# Altium schematic sheet USB-HUB-MUX.SchDoc
size A3; SheetNumber: 9; SheetTotal: 22
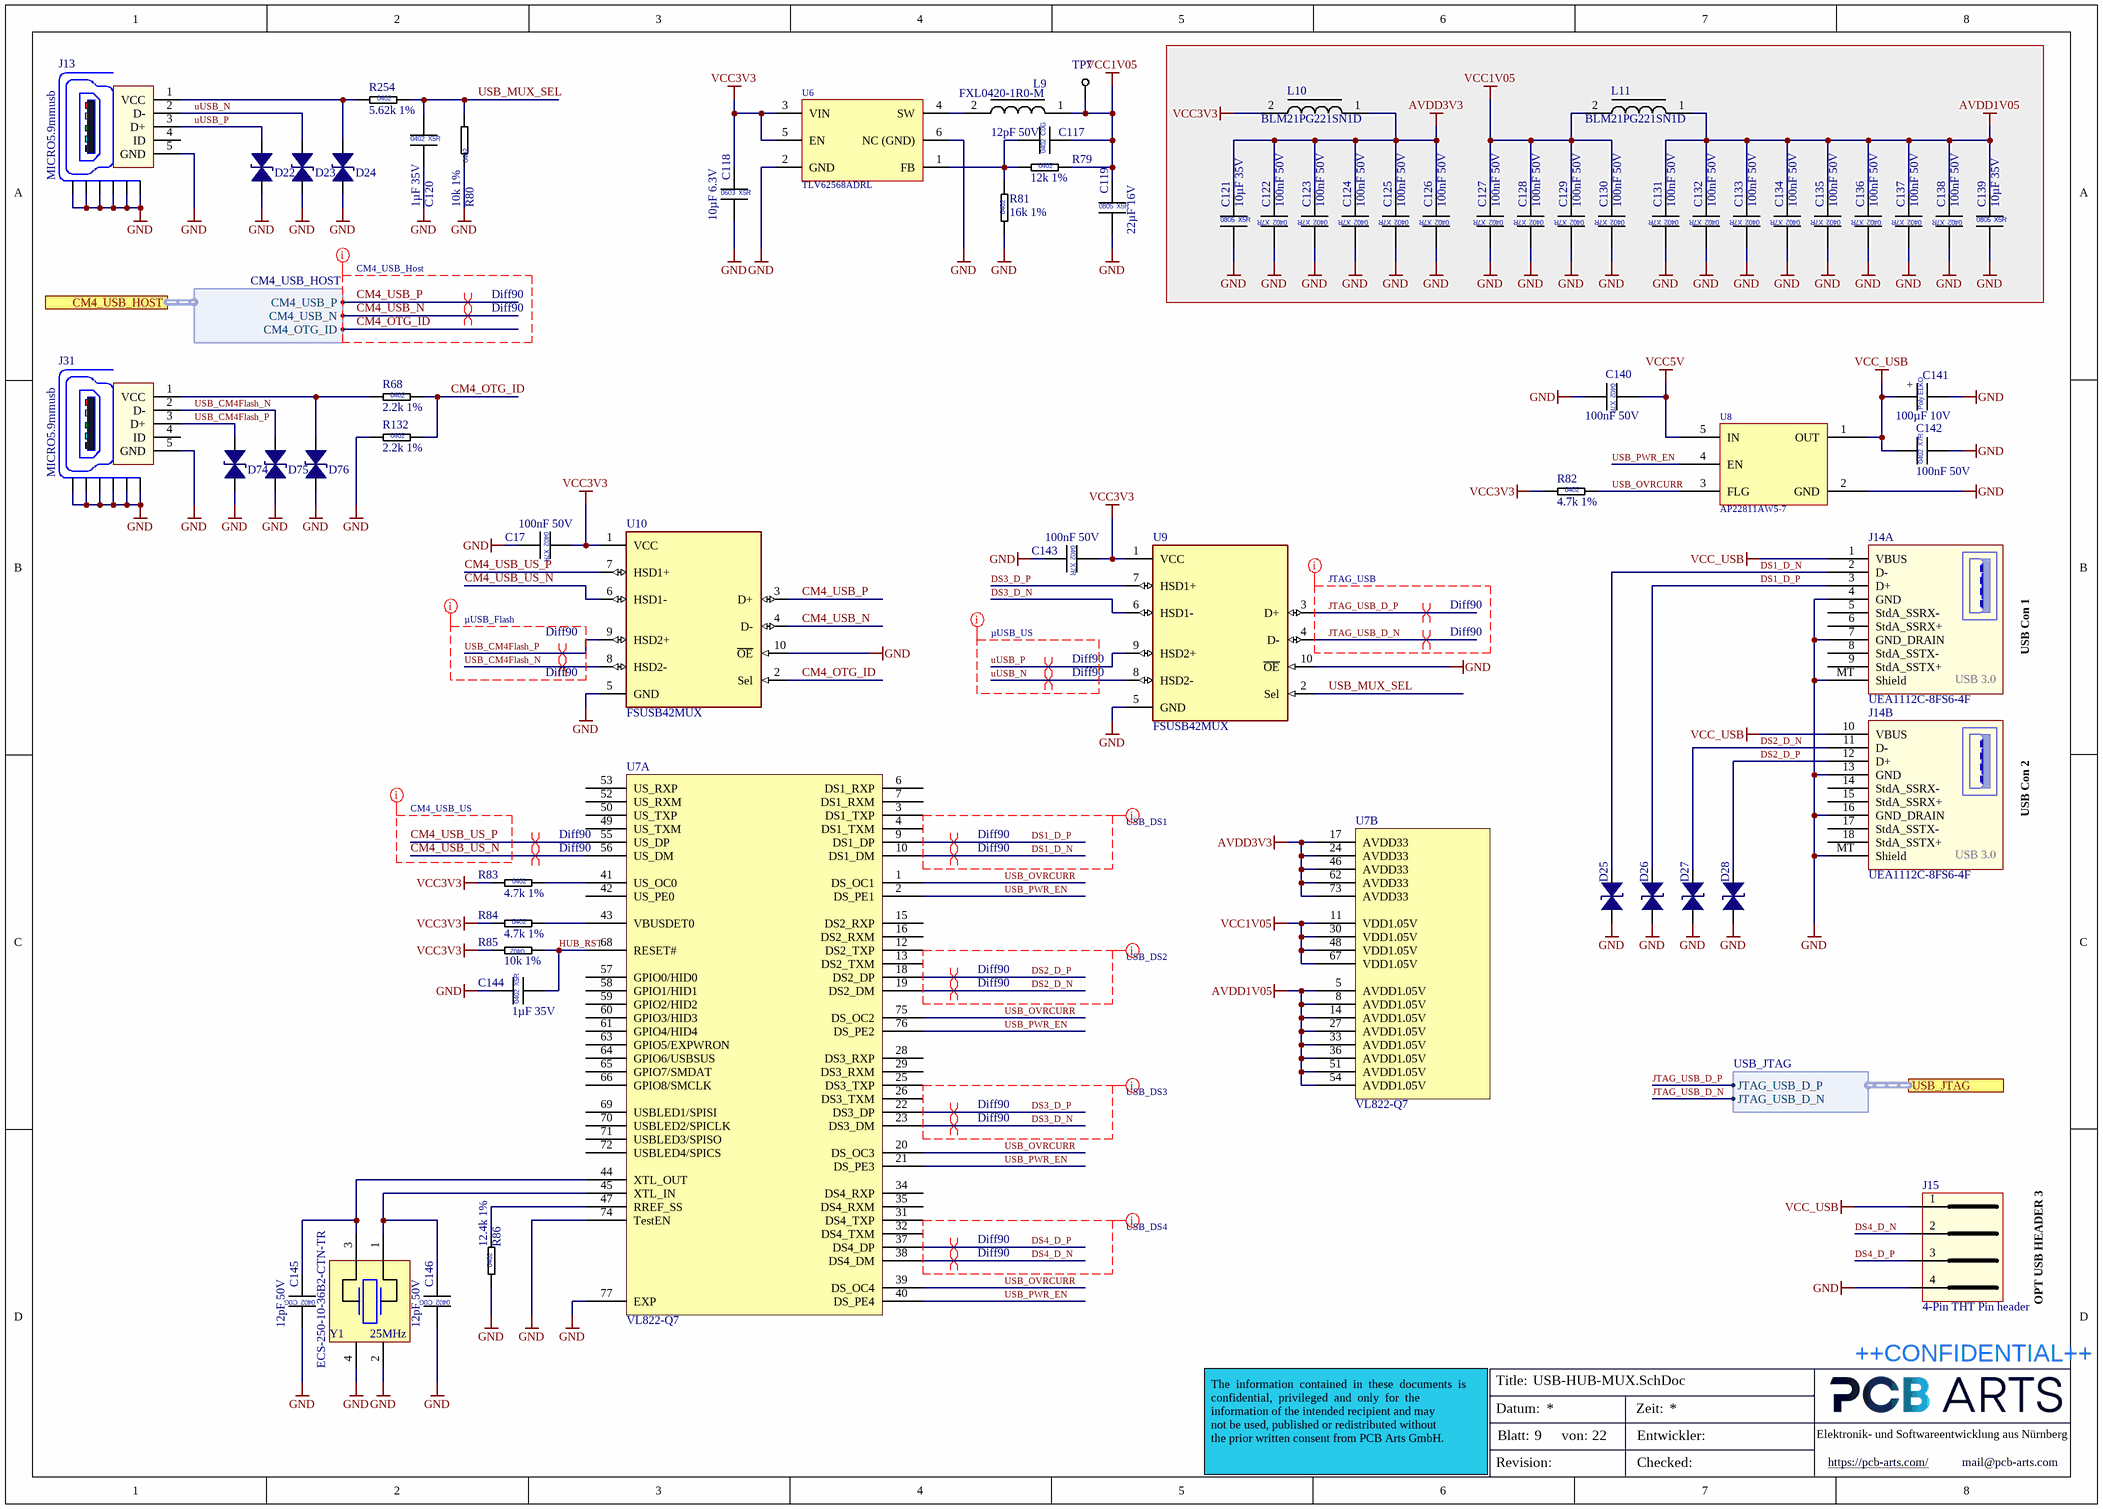
[diagram p0: USB-HUB-MUX.SchDoc]

## Parts
C17  100nF 50V  [CAP_0402_L]
C117  12pF 50V  [CAP_0402_L]
C118  10µF 6.3V  [CAP_0603_L]
C119  22µF 16V  [CAP_0805]
C120  1µF 35V  [CAP_0402_L]
C121  10µF 35V  [CAP_0805]
C122  100nF 50V  [CAP_0402_L]
C123  100nF 50V  [CAP_0402_L]
C124  100nF 50V  [CAP_0402_L]
C125  100nF 50V  [CAP_0402_L]
C126  100nF 50V  [CAP_0402_L]
C127  100nF 50V  [CAP_0402_L]
C128  100nF 50V  [CAP_0402_L]
C129  100nF 50V  [CAP_0402_L]
C130  100nF 50V  [CAP_0402_L]
C131  100nF 50V  [CAP_0402_L]
C132  100nF 50V  [CAP_0402_L]
C133  100nF 50V  [CAP_0402_L]
C134  100nF 50V  [CAP_0402_L]
C135  100nF 50V  [CAP_0402_L]
C136  100nF 50V  [CAP_0402_L]
C137  100nF 50V  [CAP_0402_L]
C138  100nF 50V  [CAP_0402_L]
C139  10µF 35V  [CAP_0805]
C140  100nF 50V  [CAP_0402_L]
C141  100µF 10V  [WCAP-ASLI_D5H5.5]
C142  100nF 50V  [CAP_0402_L]
C143  100nF 50V  [CAP_0402_L]
C144  1µF 35V  [CAP_0402_L]
C145  12pF 50V  [CAP_0402_L]
C146  12pF 50V  [CAP_0402_L]
D22  CESDP0402UC5VB  [TVS_0402]  (value not drawn)
D23  CESDP0402UC5VB  [TVS_0402]  (value not drawn)
D24  CESDP0402UC5VB  [TVS_0402]  (value not drawn)
D25  CESDP0402UC5VB  [TVS_0402]  (value not drawn)
D26  CESDP0402UC5VB  [TVS_0402]  (value not drawn)
D27  CESDP0402UC5VB  [TVS_0402]  (value not drawn)
D28  CESDP0402UC5VB  [TVS_0402]  (value not drawn)
D74  CESDP0402UC5VB  [TVS_0402]  (value not drawn)
D75  CESDP0402UC5VB  [TVS_0402]  (value not drawn)
D76  CESDP0402UC5VB  [TVS_0402]  (value not drawn)
J13  MICRO5.9mmusb  [MICRO5.9mmusb]
J14  UEA1112C-8FS6-4F  [UEA1112C-8FS6-4F]  (parts A,B of 2)
J15  4-Pin THT Pin header  [61300411121]
J31  MICRO5.9mmusb  [MICRO5.9mmusb]
L9  FXL0420-1R0-M  [FXL0420-1R0-M]
L10  BLM21PG221SN1D  [L_0805]
L11  BLM21PG221SN1D  [L_0805]
R68  2.2k 1%  [RES_0402_L]
R79  12k 1%  [RES_0402_L]
R80  10k 1%  [RES_0402_L]
R81  16k 1%  [RES_0402_L]
R82  4.7k 1%  [RES_0402_L]
R83  4.7k 1%  [RES_0402_L]
R84  4.7k 1%  [RES_0402_L]
R85  10k 1%  [RES_0402_L]
R86  12.4k 1%  [RES_0402_L]
R132  2.2k 1%  [RES_0402_L]
R254  5.62k 1%  [RES_0402_L]
TP7  Testpoint  [Testpoint 0.8mm]  (value not drawn)  (no BOM)
U6  TLV62568ADRL  [SON50P150X80-6N]
U7  VL822-Q7  [QFN50P900X900X85-76N]  (parts A,B of 2)
U8  AP22811AW5-7  [SOT95P285X140-5N]
U9  FSUSB42MUX  [SOP50P300X300X110-10N]
U10  FSUSB42MUX  [SOP50P300X300X110-10N]
Y1  ECS-250-10-36B2-CTN-TR  Frequency: 25MHz  [ECX-2236B]

## Ports
CM4_USB_HOST (harness CM4_USB_HOST, see Top-Level-Sheet[3B], Raspberry Pi CM4[8B]), USB_JTAG (harness USB_JTAG, see Top-Level-Sheet[3B], Bank 0_Bank 14[8A])

## Harnesses
CM4_USB_HOST: CM4_USB_P, CM4_USB_N, CM4_OTG_ID
USB_JTAG: JTAG_USB_D_P, JTAG_USB_D_N

## Nets
AVDD1V05: C131.2 C132.2 C133.2 C134.2 C135.2 C136.2 C137.2 C138.2 C139.1 L11.1 U7.5(AVDD1.05V) U7.8(AVDD1.05V) U7.14(AVDD1.05V) U7.27(AVDD1.05V) U7.33(AVDD1.05V) U7.36(AVDD1.05V) U7.51(AVDD1.05V) U7.54(AVDD1.05V)
AVDD3V3: C121.1 C122.2 C123.2 C124.2 C125.2 C126.2 L10.1 U7.17(AVDD33) U7.24(AVDD33) U7.46(AVDD33) U7.62(AVDD33) U7.73(AVDD33)
GND: C17.2 C118.2 C119.2 C120.2 C121.2 C122.1 C123.1 C124.1 C125.1 C126.1 C127.1 C128.1 C129.1 C130.1 C131.1 C132.1 C133.1 C134.1 C135.1 C136.1 C137.1 C138.1 C139.2 C140.2 C141.2 C142.2 C143.2 C144.1 C145.1 C146.1 D22.2 D23.2 D24.2 D25.1 D26.1 D27.1 D28.1 D74.2 D75.2 D76.2 J13.5(GND) J13.6(Shield) J13.7(Shield) J13.8(Shield) J13.9(Shield) J13.10(Shield) J13.11(Shield) J14.4(GND) J14.7(GND_DRAIN) J14.13(GND) J14.16(GND_DRAIN) J14.MT(Shield) J15.4 J31.5(GND) J31.6(Shield) J31.7(Shield) J31.8(Shield) J31.9(Shield) J31.10(Shield) J31.11(Shield) R80.1 R81.1 R86.1 R132.1 U6.2(GND) U6.6(NC_(GND)) U7.74(TestEN) U7.77(EXP) U8.2(GND) U9.5(GND) U9.10(~{OE}) U10.5(GND) U10.10(~{OE}) Y1.2 Y1.4
VCC1V05: C117.2 C119.1 C127.2 C128.2 C129.2 C130.2 L9.1 L11.2 R79.2 TP7.1(GND) U7.11(VDD1.05V) U7.30(VDD1.05V) U7.48(VDD1.05V) U7.67(VDD1.05V)
VCC3V3: C17.1 C118.1 C143.1 L10.2 R82.1 R83.1 R84.1 R85.2 U6.3(VIN) U6.5(EN) U9.1(VCC) U10.1(VCC)
VCC5V: C140.1 U8.5(IN)
VCC_USB: C141.1 C142.1 J14.1(VBUS) J14.10(VBUS) J15.1 U8.1(OUT)
CM4_OTG_ID: R68.2 R132.2 U10.2(Sel) ; port CM4_USB_HOST.CM4_OTG_ID
CM4_USB_N: U10.4(D-) ; port CM4_USB_HOST.CM4_USB_N
CM4_USB_P: U10.3(D+) ; port CM4_USB_HOST.CM4_USB_P
CM4_USB_US_N: U7.56(US_DM) U10.6(HSD1-)
CM4_USB_US_P: U7.55(US_DP) U10.7(HSD1+)
DS1_D_N: D25.2 J14.2(D-) U7.10(DS1_DM)
DS1_D_P: D26.2 J14.3(D+) U7.9(DS1_DP)
DS2_D_N: D27.2 J14.11(D-) U7.19(DS2_DM)
DS2_D_P: D28.2 J14.12(D+) U7.18(DS2_DP)
DS3_D_N: U7.23(DS3_DM) U9.6(HSD1-)
DS3_D_P: U7.22(DS3_DP) U9.7(HSD1+)
DS4_D_N: J15.2 U7.38(DS4_DM)
DS4_D_P: J15.3 U7.37(DS4_DP)
HUB_RST: C144.2 R85.1 U7.68(RESET#)
JTAG_USB_D_N: U9.4(D-) ; port USB_JTAG.JTAG_USB_D_N
JTAG_USB_D_P: U9.3(D+) ; port USB_JTAG.JTAG_USB_D_P
USB_CM4Flash_N: D75.1 J31.2(D-) U10.8(HSD2-)
USB_CM4Flash_P: D74.1 J31.3(D+) U10.9(HSD2+)
USB_MUX_SEL: C120.1 R80.2 R254.2 U9.2(Sel)
USB_OVRCURR: R82.2 U7.1(DS_OC1) U7.20(DS_OC3) U7.39(DS_OC4) U7.75(DS_OC2) U8.3(FLG)
USB_PWR_EN: U7.2(DS_PE1) U7.21(DS_PE3) U7.40(DS_PE4) U7.76(DS_PE2) U8.4(EN)
uUSB_N: D23.1 J13.2(D-) U9.8(HSD2-)
uUSB_P: D22.1 J13.3(D+) U9.9(HSD2+)
NetC117_1: C117.1 R79.1 R81.2 U6.1(FB)
NetC145_2: C145.2 U7.44(XTL_OUT) Y1.3
NetC146_2: C146.2 U7.45(XTL_IN) Y1.1
NetD24_1: D24.1 J13.1(VCC) R254.1
NetD76_1: D76.1 J31.1(VCC) R68.1
NetL9_2: L9.2 U6.4(SW)
NetR83_2: R83.2 U7.41(US_OC0)
NetR84_2: R84.2 U7.43(VBUSDET0)
NetR86_2: R86.2 U7.47(RREF_SS)

Not connected (* = marked no-connect by the designer): J13 4(ID); J14 5(StdA_SSRX-) 6(StdA_SSRX+) 8(StdA_SSTX-) 9(StdA_SSTX+) 14(StdA_SSRX-) 15(StdA_SSRX+) 17(StdA_SSTX-) 18(StdA_SSTX+); J31 4(ID); U7 3(DS1_TXP) 4(DS1_TXM) 6(DS1_RXP) 7(DS1_RXM) 12(DS2_TXP) 13(DS2_TXM) 15(DS2_RXP) 16(DS2_RXM) 25(DS3_TXP) 26(DS3_TXM) 28(DS3_RXP) 29(DS3_RXM) 31(DS4_TXP) 32(DS4_TXM) 34(DS4_RXP) 35(DS4_RXM) 42(US_PE0) 49(US_TXM) 50(US_TXP) 52(US_RXM) 53(US_RXP) 57(GPIO0/HID0) 58(GPIO1/HID1) 59(GPIO2/HID2) 60(GPIO3/HID3) 61(GPIO4/HID4) 63(GPIO5/EXPWRON) 64(GPIO6/USBSUS) 65(GPIO7/SMDAT) 66(GPIO8/SMCLK) 69(USBLED1/SPISI) 70(USBLED2/SPICLK) 71(USBLED3/SPISO) 72(USBLED4/SPICS)

## Layout directives
net class USB_DS4: DS4_D_N, DS4_D_P
differential pair; net class Diff90: CM4_USB_N, CM4_USB_P, CM4_USB_US_N, CM4_USB_US_P, DS1_D_N, DS1_D_P, DS2_D_N, DS2_D_P, DS3_D_N, DS3_D_P, DS4_D_N, DS4_D_P, JTAG_USB_D_N, JTAG_USB_D_P, USB_CM4Flash_N, USB_CM4Flash_P, uUSB_N, uUSB_P
net class USB_DS3: DS3_D_N, DS3_D_P
net class USB_DS2: DS2_D_N, DS2_D_P
net class USB_DS1: DS1_D_N, DS1_D_P
net class µUSB_US: uUSB_N, uUSB_P
net class JTAG_USB: JTAG_USB_D_N, JTAG_USB_D_P
net class µUSB_Flash: USB_CM4Flash_N, USB_CM4Flash_P
net class CM4_USB_Host: CM4_OTG_ID, CM4_USB_N, CM4_USB_P
net class CM4_USB_US: CM4_USB_US_N, CM4_USB_US_P

## Notes on the sheet
- USB Con 1
- USB Con 2
- OPT USB HEADER 3
- Title:
- ++CONFIDENTIAL++
- Datum:
- Blatt:
- von:
- Zeit:
- Entwickler:
- Elektronik- und Softwareentwicklung aus Nürnberg
- The  information  contained  in  these  documents  is  confidential,  privileged  and  only  for  the
  information of the intended recipient and may
  not be used, published or redistributed without
  the prior written consent from PCB Arts GmbH.
- Revision:
- Checked:
- https://pcb-arts.com/
- mail@pcb-arts.com
- (in symbol CAP_0402_1µF_35V) X5R; 0402
- (in symbol CAP_0402_12pF_50V) C0G; 0402
- (in symbol CAP_0402_100nF_50V) X7R; 0402
- (in symbol CAP_0603_10µF_6.3V) 0603; X5R
- (in symbol CAP_0805_10µF_35V) 0805; X5R
- (in symbol CAP_0805_22µF_16V) 0805; X5R
- (in symbol CAP_D5L5.5_100µF_10V) +; Poly ELKO
- (in symbol RES_0402_2.2k_1%) 0402
- (in symbol RES_0402_4.7k_1%) 0402
- (in symbol RES_0402_5.62k_1%) 0402
- (in symbol RES_0402_10k_1%) 0402
- (in symbol RES_0402_12.4k_1%) 0402
- (in symbol RES_0402_12k_1%) 0402
- (in symbol RES_0402_16k_1%) 0402
- (in symbol UEA1112C-8FS6-4F_Dual USB 3.0 Horizontal Type A_1, part A) USB 3.0
- (in symbol UEA1112C-8FS6-4F_Dual USB 3.0 Horizontal Type A_1, part B) USB 3.0

## Library data of the parts
C17 C122-C138 C140 C142 C143 = CAP_0402_100nF_50V: Multilayer Ceramic Capacitors MLCC - SMD/SMT 0402 50VDC; Manufacturer 1: Murata Electronics; Manufacturer 1 Prt. Nr.: GCM155L8EH104KE07D; Manufacturer 2 Prt. Nr.: UMK105B7104KV-FR; Manufacturer 2: TDK
C117 C145 C146 = CAP_0402_12pF_50V: Multilayer Ceramic Capacitors MLCC - SMD/SMT 0402 50VDC; Manufacturer 1: Murata Electronics; Manufacturer 1 Prt. Nr.: GCM1555C1H120JA16J; Manufacturer 2 Prt. Nr.: C0402C120J5GACTU; Manufacturer 2: KEMET
C118 = CAP_0603_10µF_6.3V: Multilayer Ceramic Capacitors MLCC - SMD/SMT 0603 6.3VDC; Manufacturer 1: Murata Electronics; Manufacturer 1 Prt. Nr.: GRM188R60J106ME84J; Manufacturer 2 Prt. Nr.: JMK107ABJ106MA-T; Manufacturer 2: Taiyo Yuden
C119 = CAP_0805_22µF_16V: Multilayer Ceramic Capacitors MLCC - SMD/SMT 0805 16VDC; Manufacturer 1: Samsung Electro-Mechanics; Manufacturer 1 Prt. Nr.: CL21A226KOQNNNG; Manufacturer 2 Prt. Nr.: GRM21BC81C226ME44K; Manufacturer 2: Murata Electronics
C120 C144 = CAP_0402_1µF_35V: Multilayer Ceramic Capacitors MLCC - SMD/SMT 0402 35VDC; Manufacturer 1: Kyocera Electronic Components; Manufacturer 1 Prt. Nr.: CM05X5R105K35AH; Manufacturer 2 Prt. Nr.: C1005X5R1V105K050BC; Manufacturer 2: TDK
C121 C139 = CAP_0805_10µF_35V: Multilayer Ceramic Capacitors MLCC - SMD/SMT 0805 35VDC; Manufacturer 1: Murata Electronics; Manufacturer 1 Prt. Nr.: GRM21BR6YA106ME43L; Manufacturer 2 Prt. Nr.: C2012X5R1V106M085AC; Manufacturer 2: TDK
C141 = CAP_D5L5.5_100µF_10V: Organische Polymer-Aluminiumkondensatoren 100uF 10 Volts 20%; Manufacturer 1: Würth Elektronik; Manufacturer 1 Prt. Nr.: 875105242010
D22-D28 D74-D76 = CESDP0402UC5VB_TVS Diode 0402: Low Capacitance ESD Protection Diode 0402; Manufacturer 1: CREATEK; Manufacturer 2 Prt. Nr.: BPESD0402-05ST; Manufacturer 1 Prt. Nr.: CESDP0402UC5VB; Manufacturer 2: BORN
J13 J31 = SMD micro USB Connector Horizontal C393940: SHOU HAN  MICRO5.9mmusb; Manufacturer 1: SHOU HAN; Manufacturer 1 Prt. Nr.: MICRO5.9mmusb
J14 = UEA1112C-8FS6-4F_Dual USB 3.0 Horizontal Type A_1: Dual USB 3.0 Horizontal Type A; Manufacturer 1: Foxconn; Manufacturer 2 Prt. Nr.: USB-HX-19DIP; Manufacturer 1 Prt. Nr.: UEA1112C-8FS6-4F; Manufacturer 2: HDGC
J15 = 61300411121_WR-PHD 2.54mm 4Pin THT Header: WR-PHD 2.54mm 4Pin THT Header; Manufacturer 1: Würth Elektronik; Manufacturer 1 Prt. Nr.: 61300411121
L9 = 1uH 6A 27mΩ  FXL0420-1R0-M: 1uH ±20% 6A 27mΩ SMD,4.4x4.5x1.8mm Power Inductor; Manufacturer 1: cjiang(Changjiang Microelectronics Tech); Manufacturer 1 Prt. Nr.: FXL0420-1R0-M
L10 L11 = Ferrite Beads 0805 220 OHM BLM21PG221SN1D: Ferrite Beads 0805 220 OHM; Manufacturer 1: Murata Electronics; Manufacturer 1 Prt. Nr.: BLM21PG221SN1D
R68 R132 = RES_0402_2.2k_1%: Thick Film Resistors - SMD 2.2kOhm 1%; Manufacturer 1: Vishay / Dale; Manufacturer 1 Prt. Nr.: CRCW04022K20FKEDC; Manufacturer 2 Prt. Nr.: AF0402FR-072K2L; Manufacturer 2: Yageo
R79 = RES_0402_12k_1%: Thick Film Resistors - SMD 12kOhm 1%; Manufacturer 1: Vishay / Dale; Manufacturer 1 Prt. Nr.: CRCW040212K0FKEDC; Manufacturer 2 Prt. Nr.: RC0402FR-7W12KL; Manufacturer 2: Yageo
R80 R85 = RES_0402_10k_1%: Thick Film Resistors - SMD 10kOhm 1%; Manufacturer 1: Vishay / Dale; Manufacturer 1 Prt. Nr.: CRCW040210K0FKEDC; Manufacturer 2 Prt. Nr.: RC0402FR-7W10KL; Manufacturer 2: Yageo
R81 = RES_0402_16k_1%: Thick Film Resistors - SMD 16kOhm 1%; Manufacturer 1: Vishay / Dale; Manufacturer 1 Prt. Nr.: CRCW040216K0FKED; Manufacturer 2 Prt. Nr.: RC0402FR-0716KL; Manufacturer 2: Yageo
R82-R84 = RES_0402_4.7k_1%: Thick Film Resistors - SMD 4.7kOhm 1%; Manufacturer 1: Vishay / Dale; Manufacturer 1 Prt. Nr.: CRCW04024K70FKEDC; Manufacturer 2 Prt. Nr.: RC0402FR-134K7L; Manufacturer 2: Yageo
R86 = RES_0402_12.4k_1%: Thick Film Resistors - SMD 12.4kOhm 1%; Manufacturer 1: Vishay / Dale; Manufacturer 1 Prt. Nr.: CRCW040212K4FKEDC; Manufacturer 2 Prt. Nr.: RC0402FR-0712K4L; Manufacturer 2: Yageo
R254 = RES_0402_5.62k_1%: Thick Film Resistors - SMD 5.62kOhm 1%; Manufacturer 1: Vishay / Dale; Manufacturer 1 Prt. Nr.: CRCW04025K62FKEDC; Manufacturer 2 Prt. Nr.: AC0402FR-7W5K62L; Manufacturer 2: Yageo
TP7 = Testpoint 0.8mm
U6 = TLV62568ADRL_Step Down Converter 1A; 2A: Step Down Converter with Forced PWM in SOT563 Package; Manufacturer 1: Texas Instruments; Manufacturer 1 Prt. Nr.: TLV62568ADRL
U7 = VL822-Q7_USB Interface IC  USB 3.1 Hub 4 Ports: USB Interface IC  USB 3.1 Hub 4 Ports; Manufacturer 1: VIA Labs; Manufacturer 1 Prt. Nr.: VL822-Q7
U8 = AP22811AW5-7_Power Switch ICs - Power Distribution Load Switch: Power Switch ICs - Power Distribution Load Switch; Manufacturer 1: Diodes Incorporated; Manufacturer 1 Prt. Nr.: AP22811AW5-7
U9 U10 = FSUSB42MUX_IC USB SWITCH DPDT: IC USB SWITCH DPDT; Manufacturer 1: onsemi / Fairchild; Manufacturer 1 Prt. Nr.: FSUSB42MUX
Y1 = Quarz 25MHz ESR 50R10pF: 2.5 x 2.0 x 0.55 mm SMD Crystal; Manufacturer 1: ECS; Manufacturer 1 Prt. Nr.: ECS-250-10-36B2-CTN-TR